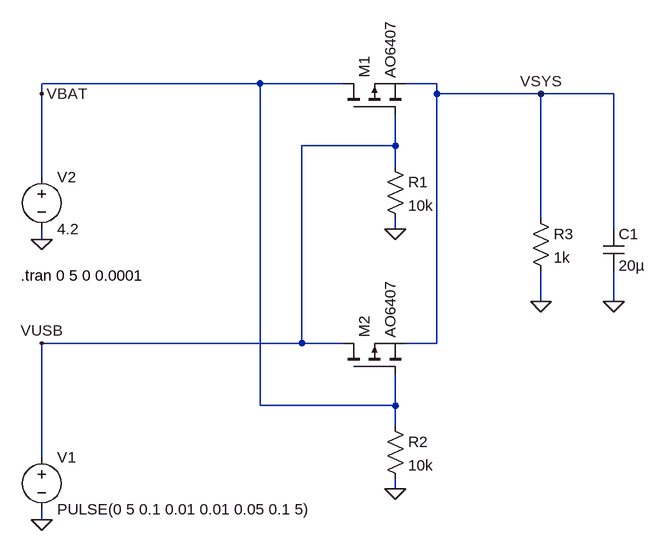
[diagram p0: schematic Draft6.asc]
Draft6.asc, the LTspice schematic file:
Version 4.1
SHEET 1 880 680
WIRE 48 -272 -288 -272
WIRE 176 -272 48 -272
WIRE 320 -272 272 -272
WIRE -288 -256 -288 -272
WIRE 320 -256 320 -272
WIRE 480 -256 320 -256
WIRE 592 -256 480 -256
WIRE 256 -176 256 -224
WIRE 256 -176 112 -176
WIRE 256 -144 256 -176
WIRE -288 -128 -288 -256
WIRE 480 -64 480 -256
WIRE 256 -48 256 -64
WIRE 592 -48 592 -256
WIRE -288 -32 -288 -48
WIRE 480 64 480 16
WIRE 592 64 592 16
WIRE 112 128 112 -176
WIRE 112 128 -288 128
WIRE 176 128 112 128
WIRE 320 128 320 -256
WIRE 320 128 272 128
WIRE 48 224 48 -272
WIRE 256 224 256 176
WIRE 256 224 48 224
WIRE 256 256 256 224
WIRE -288 304 -288 128
WIRE 256 352 256 336
WIRE -288 400 -288 384
FLAG 256 -48 0
FLAG -288 -32 0
FLAG -288 400 0
FLAG -288 -256 VBAT
FLAG 480 -256 VSYS
FLAG -288 128 VUSB
FLAG 256 352 0
FLAG 480 64 0
FLAG 592 64 0
SYMBOL pmos 176 -224 R270
SYMATTR InstName M1
SYMATTR Value AO6407
SYMBOL res 240 -160 R0
SYMATTR InstName R1
SYMATTR Value 10k
SYMBOL voltage -288 288 R0
WINDOW 123 0 0 Left 0
WINDOW 39 0 0 Left 0
SYMATTR InstName V1
SYMATTR Value PULSE(0 5 0.1 0.01 0.01 0.05 0.1 5)
SYMBOL voltage -288 -144 R0
WINDOW 123 0 0 Left 0
WINDOW 39 0 0 Left 0
SYMATTR InstName V2
SYMATTR Value 4.2
SYMBOL pmos 176 176 R270
SYMATTR InstName M2
SYMATTR Value AO6407
SYMBOL res 240 240 R0
SYMATTR InstName R2
SYMATTR Value 10k
SYMBOL res 464 -80 R0
SYMATTR InstName R3
SYMATTR Value 1k
SYMBOL cap 576 -48 R0
SYMATTR InstName C1
SYMATTR Value 20µ
TEXT -320 24 Left 2 !.tran 0 5 0 0.0001

The netlist it stands for:
* Draft6.asc
M1 VBAT VUSB VSYS VSYS AO6407
R1 VUSB 0 10k
V1 VUSB 0 PULSE(0 5 0.1 0.01 0.01 0.05 0.1 5)
V2 VBAT 0 4.2
M2 VUSB VBAT VSYS VSYS AO6407
R2 VBAT 0 10k
R3 VSYS 0 1k
C1 VSYS 0 20µ
.model NMOS NMOS
.model PMOS PMOS
.lib standard.mos
.tran 0 5 0 0.0001
.backanno
.end